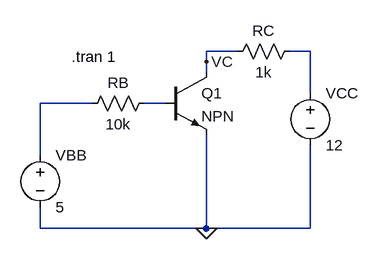
[diagram p0: schematic Draft9.asc]
Draft9.asc, the LTspice schematic file:
Version 4
SHEET 1 880 680
WIRE 304 16 256 16
WIRE 416 16 384 16
WIRE 256 32 256 16
WIRE 256 48 256 32
WIRE 416 80 416 16
WIRE 80 96 0 96
WIRE 192 96 160 96
WIRE 0 176 0 96
WIRE 0 288 0 256
WIRE 256 288 256 144
WIRE 256 288 0 288
WIRE 416 288 416 160
WIRE 416 288 256 288
FLAG 256 288 0
FLAG 256 32 VC
SYMBOL voltage 0 160 R0
WINDOW 123 0 0 Left 0
WINDOW 39 0 0 Left 0
SYMATTR InstName VBB
SYMATTR Value 5
SYMBOL voltage 416 64 R0
WINDOW 123 0 0 Left 0
WINDOW 39 0 0 Left 0
SYMATTR InstName VCC
SYMATTR Value 12
SYMBOL res 176 80 R90
WINDOW 0 0 56 VBottom 2
WINDOW 3 32 56 VTop 2
SYMATTR InstName RB
SYMATTR Value 10k
SYMBOL res 400 0 R90
WINDOW 0 0 56 VBottom 2
WINDOW 3 32 56 VTop 2
SYMATTR InstName RC
SYMATTR Value 1k
SYMBOL npn 192 48 R0
SYMATTR InstName Q1
TEXT 48 24 Left 2 !.tran 1

The netlist it stands for:
* Draft9.asc
VBB N002 0 5
VCC N001 0 12
RB N003 N002 10k
RC N001 VC 1k
Q1 VC N003 0 0 NPN
.model NPN NPN
.model PNP PNP
.lib standard.bjt
.tran 1
.backanno
.end